# Altium schematic sheet power_supply.SchDoc: Power Supply
size A4; Author: AJ; DrawnBy: AJ; Engineer: AJ; DocumentNumber: 2; Revision: 003; SheetNumber: 2; SheetTotal: 6; Description: Switching power supply and a low dropout  regulator.
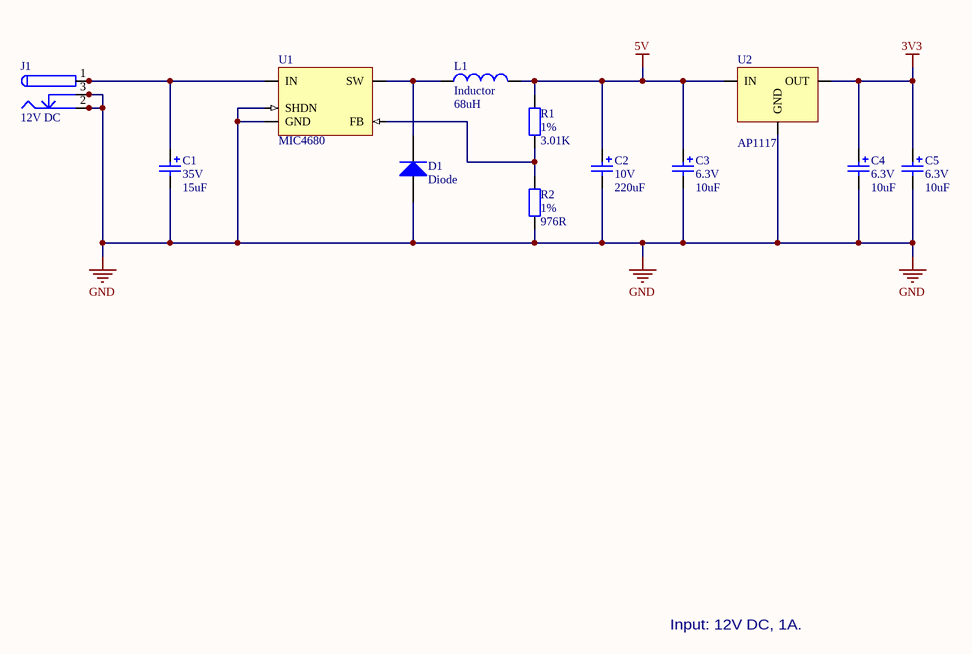
[diagram p0: power_supply.SchDoc]

## Parts
C1  35V  value 15uF  [EIA-7343]
C2  10V  value 220uF  [EIA-7343]
C3  6.3V  value 10uF  [EIA-3216]
C4  6.3V  value 10uF  [EIA-3216]
C5  6.3V  value 10uF  [EIA-3216]
D1  Diode  [Diode (SMA)]
J1  12V DC  [DC Jack]
L1  Inductor  value 68uH  [Inductor EPCOS]
R1  1%  value 3.01K  [0603]
R2  1%  value 976R  [0603]
U1  MIC4680  [SO-8]
U2  AP1117  [TO252 HS]

## Nets
3V3: C4.1 C5.1 U2.2(OUT)
5V: C2.1 C3.1 L1.2 R1.2 U2.3(IN)
GND: C1.2 C2.2 C3.2 C4.2 C5.2 D1.1(A) J1.2 J1.2A J1.2B J1.3 J1.3A J1.3B R2.1 U1.1(SHDN) U1.5(GND) U1.6(GND) U1.7(GND) U1.8(GND) U2.1(GND)
NetC1_1: C1.1 J1.1 J1.1A J1.1B U1.2(IN)
NetD1_2: D1.2(K) L1.1 U1.3(SW)
NetR1_1: R1.1 R2.2 U1.4(FB)

## Notes on the sheet
- Input: 12V DC, 1A.
- TITLE
- DESCRIPTION
- SHEET
- of
- ENGINEER
- DATE
- REVISION
- AUTHOR
- FILE

## Library data of the parts
C1-C5 = Cap Pol2: Polarized Capacitor (Axial); Published: 8-Jun-2000; LatestRevisionDate: 17-Jul-2002; LatestRevisionNote: Re-released for DXP Platform.; PackageReference: POLAR0.8; Publisher: Altium Limited
D1 = Diode: Default Diode; Published: 8-Jun-2000; LatestRevisionDate: 17-Jul-2002; LatestRevisionNote: Re-released for DXP Platform.; PackageVersion: Sep-1996; PackageReference: SMC; Publisher: Altium Limited; Code_JEDEC: DO-214-AB
J1 = PWR2.5: Low Voltage Power Supply Connector; Published: 17-Dec-2003; DatasheetDocument: 09-May-2002; Publisher: Altium Limited; ComponentLink1Description: Manufacturer Link; ComponentLink1URL: http://domino.kycon.com/internet/Products.html
L1 = Inductor: Code_IEC: 1005; Published: 8-Jun-2000; LatestRevisionDate: 29-May-2009; LatestRevisionNote: IPC-7351 Footprint Added.; PackageReference: 0402-A; Publisher: Altium Limited; PackageDescription: Chip Inductor; Code_JEITA: 0402
R1 R2 = Res2: Resistor; Published: 8-Jun-2000; LatestRevisionDate: 17-Jul-2002; LatestRevisionNote: Re-released for DXP Platform.; PackageReference: AXIAL-0.4; Publisher: Altium Limited
U1 = MIC4680: 1A 200kHz Buck Regulator
U2 = AP1117: Low Dropout Regulator